# EAGLE design MyBuffer (EAGLE 9.0.1)
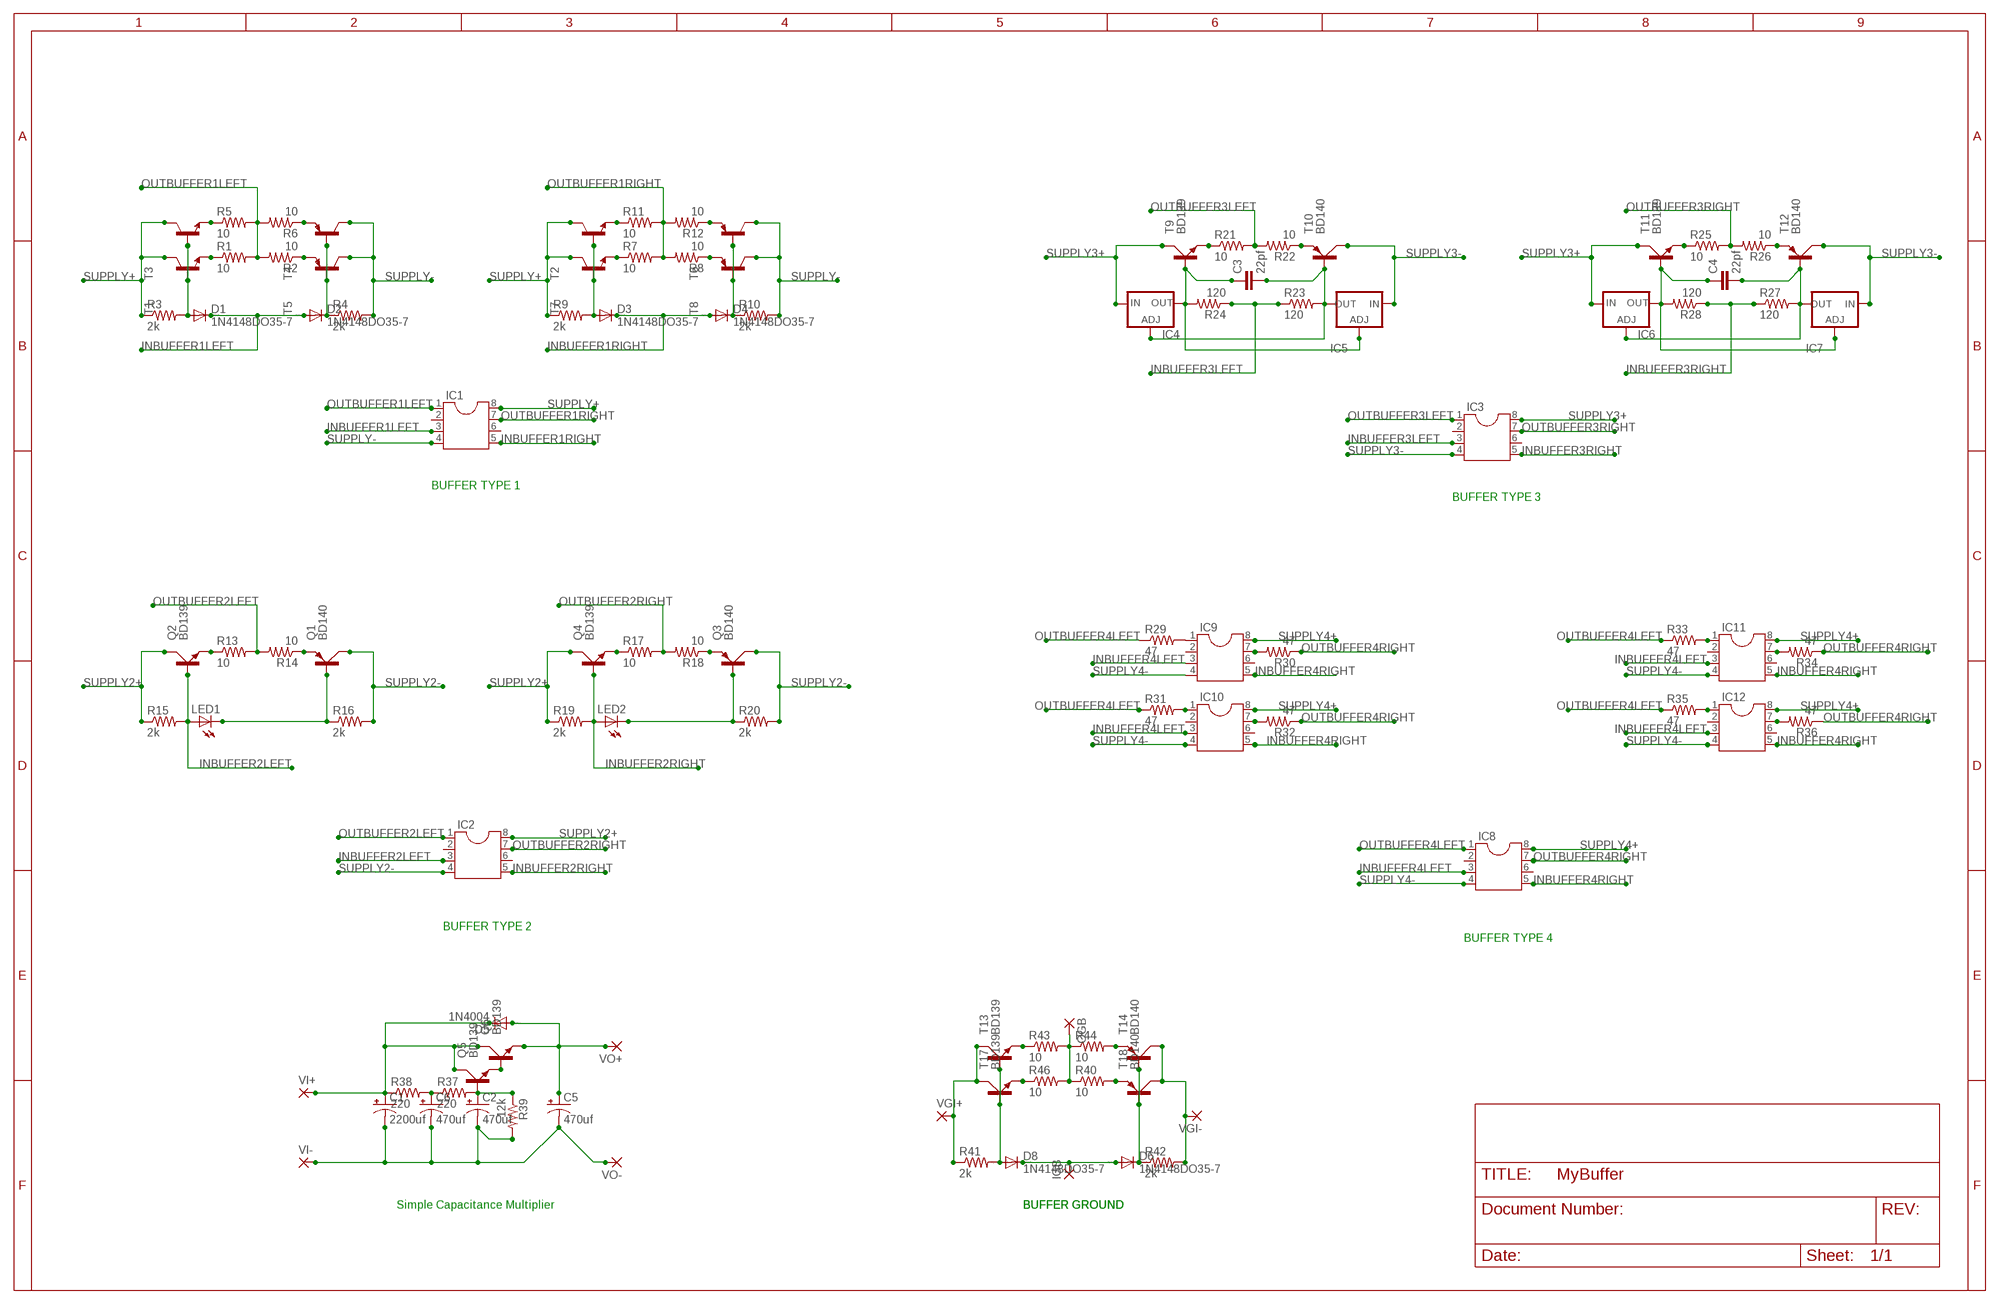
[diagram p0: schematic, sheet 1]

## Parts
C1  2200uf  CPOL-USE7.5-16  [E7,5-16]
C2  470uf  CPOL-USE7.5-16  [E7,5-16]
C3  22pf  C5/2.5  [C5B2.5]
C4  22pf  C5/2.5  [C5B2.5]
C5  470uf  CPOL-USE7.5-16  [E7,5-16]
C6  470uf  CPOL-USE7.5-16  [E7,5-16]
D1  1N4148DO35-7  [DO35-7]
D2  1N4148DO35-7  [DO35-7]
D3  1N4148DO35-7  [DO35-7]
D4  1N4148DO35-7  [DO35-7]
D5  1N4004  [DO41-10]
D6  1N4148DO35-7  [DO35-7]
D8  1N4148DO35-7  [DO35-7]
IC1  DIL8  [DIL08]
IC2  DIL8  [DIL08]
IC3  DIL8  [DIL08]
IC4  LM317TS  [317TS]
IC5  LM337TS  [337TS]
IC6  LM317TS  [317TS]
IC7  LM337TS  [337TS]
IC8  DIL8  [DIL08]
IC9  DIL8  [DIL08]
IC10  DIL8  [DIL08]
IC11  DIL8  [DIL08]
IC12  DIL8  [DIL08]
IGB  2,54/0,8  [2,54/0,8]
LED1  LED3MM  [LED3MM]
LED2  LED3MM  [LED3MM]
OGB  2,54/0,8  [2,54/0,8]
Q1  BD140  [TO126AV]
Q2  BD139  [TO126AV]
Q3  BD140  [TO126AV]
Q4  BD139  [TO126AV]
Q5  BD139  [TO126AV]
Q6  BD139  [TO126AV]
R1  10  R-US_0207/10  [0207/10]
R2  10  R-US_0207/10  [0207/10]
R3  2k  R-US_0207/10  [0207/10]
R4  2k  R-US_0207/10  [0207/10]
R5  10  R-US_0207/2V  [0207/2V]
R6  10  R-US_0207/2V  [0207/2V]
R7  10  R-US_0207/10  [0207/10]
R8  10  R-US_0207/10  [0207/10]
R9  2k  R-US_0207/10  [0207/10]
R10  2k  R-US_0207/10  [0207/10]
R11  10  R-US_0207/2V  [0207/2V]
R12  10  R-US_0207/2V  [0207/2V]
R13  10  R-US_0207/10  [0207/10]
R14  10  R-US_0207/10  [0207/10]
R15  2k  R-US_0207/10  [0207/10]
R16  2k  R-US_0207/10  [0207/10]
R17  10  R-US_0207/10  [0207/10]
R18  10  R-US_0207/10  [0207/10]
R19  2k  R-US_0207/10  [0207/10]
R20  2k  R-US_0207/10  [0207/10]
R21  10  R-US_0207/10  [0207/10]
R22  10  R-US_0207/10  [0207/10]
R23  120  R-US_0207/10  [0207/10]
R24  120  R-US_0207/10  [0207/10]
R25  10  R-US_0207/10  [0207/10]
R26  10  R-US_0207/10  [0207/10]
R27  120  R-US_0207/10  [0207/10]
R28  120  R-US_0207/10  [0207/10]
R29  47  R-US_0207/10  [0207/10]
R30  47  R-US_0207/10  [0207/10]
R31  47  R-US_0207/10  [0207/10]
R32  47  R-US_0207/10  [0207/10]
R33  47  R-US_0207/10  [0207/10]
R34  47  R-US_0207/10  [0207/10]
R35  47  R-US_0207/10  [0207/10]
R36  47  R-US_0207/10  [0207/10]
R37  220  R-US_0207/10  [0207/10]
R38  220  R-US_0207/10  [0207/10]
R39  12k  R-US_0207/10  [0207/10]
R40  10  R-US_0207/10  [0207/10]
R41  2k  R-US_0207/10  [0207/10]
R42  2k  R-US_0207/10  [0207/10]
R43  10  R-US_0207/10  [0207/10]
R44  10  R-US_0207/10  [0207/10]
R46  10  R-US_0207/10  [0207/10]
T1  29-NPN-TO92-EBC  [TO92-EBC]
T2  29-NPN-TO92-EBC  [TO92-EBC]
T3  29-NPN-TO92-EBC  [TO92-EBC]
T4  2N5401-PNP-TO92-EBC  [TO92-EBC]
T5  2N5401-PNP-TO92-EBC  [TO92-EBC]
T6  2N5401-PNP-TO92-EBC  [TO92-EBC]
T7  29-NPN-TO92-EBC  [TO92-EBC]
T8  2N5401-PNP-TO92-EBC  [TO92-EBC]
T9  BD139  [TO126AV]
T10  BD140  [TO126AV]
T11  BD139  [TO126AV]
T12  BD140  [TO126AV]
T13  BD139  [TO126AV]
T14  BD140  [TO126AV]
T17  BD139  [TO126AV]
T18  BD140  [TO126AV]
VGI+  2,54/0,8  [2,54/0,8]
VGI-  2,54/0,8  [2,54/0,8]
VI+  2,54/0,8  [2,54/0,8]
VI-  2,54/0,8  [2,54/0,8]
VO+  2,54/0,8  [2,54/0,8]
VO-  2,54/0,8  [2,54/0,8]

## Nets
INBUFFER1LEFT: D1.C D2.A IC1.3
INBUFFER1RIGHT: D3.C D4.A IC1.5
INBUFFER2LEFT: IC2.3 LED1.A Q2.B R15.2
INBUFFER2RIGHT: IC2.5 LED2.A Q4.B R19.2
INBUFFER3LEFT: IC3.3 R23.1 R24.1
INBUFFER3RIGHT: IC3.5 R27.1 R28.1
INBUFFER4LEFT: IC8.3 IC9.3 IC10.3 IC11.3 IC12.3
INBUFFER4RIGHT: IC8.5 IC9.5 IC10.5 IC11.5 IC12.5
N$1: R1.1 T1.E
N$2: R2.1 T5.E
N$3: D3.A R9.2 T2.B T7.B
N$4: D1.A R3.2 T1.B T3.B
N$5: D2.C R4.1 T4.B T5.B
N$6: R6.1 T4.E
N$7: R5.1 T3.E
N$8: D4.C R10.1 T6.B T8.B
N$10: R7.1 T7.E
N$11: R8.1 T8.E
N$12: R11.1 T2.E
N$13: R12.1 T6.E
N$15: Q2.E R13.1
N$16: Q4.E R17.1
N$17: Q1.E R14.1
N$18: Q3.E R18.1
N$19: LED2.K(C) Q3.B R20.1
N$21: LED1.K(C) Q1.B R16.1
N$22: R21.1 T9.E
N$23: R22.1 T10.E
N$24: C4.1 IC6.2(OUT) IC7.1(ADJ) R28.2 T11.B
N$25: C3.1 IC4.2(OUT) IC5.1(ADJ) R24.2 T9.B
N$26: C3.2 IC4.1(ADJ) IC5.3(OUT) R23.2 T10.B
N$27: C4.2 IC6.1(ADJ) IC7.3(OUT) R27.2 T12.B
N$28: R25.1 T11.E
N$29: R26.1 T12.E
N$31: IC9.1 R29.2
N$32: C2.+ Q5.B R37.2 R39.1
N$33: Q5.E Q6.B
N$34: IC9.7 R30.2
N$35: C6.+ R37.1 R38.2
N$36: C1.+ D5.C Q5.C Q6.C R38.1 VI+.1(P)
N$37: C1.- C2.- C5.- C6.- R39.2 VI-.1(P) VO-.1(P)
N$38: IC10.1 R31.2
N$39: C5.+ D5.A Q6.E VO+.1(P)
N$40: OGB.1(P) R40.1 R43.2 R44.1 R46.2
N$41: IC10.7 R32.2
N$42: R46.1 T17.E
N$43: IC11.1 R33.2
N$44: R40.2 T18.E
N$45: D6.C R42.1 T14.B T18.B
N$46: D8.A R41.2 T13.B T17.B
N$47: IC11.7 R34.2
N$48: R41.1 T13.C T17.C VGI+.1(P)
N$49: IC12.1 R35.2
N$50: R42.2 T14.C T18.C VGI-.1(P)
N$51: D6.A D8.C IGB.1(P)
N$52: R43.1 T13.E
N$53: IC12.7 R36.2
N$54: R44.2 T14.E
OUTBUFFER1LEFT: IC1.1 R1.2 R2.2 R5.2 R6.2
OUTBUFFER1RIGHT: IC1.7 R7.2 R8.2 R11.2 R12.2
OUTBUFFER2LEFT: IC2.1 R13.2 R14.2
OUTBUFFER2RIGHT: IC2.7 R17.2 R18.2
OUTBUFFER3LEFT: IC3.1 R21.2 R22.2
OUTBUFFER3RIGHT: IC3.7 R25.2 R26.2
OUTBUFFER4LEFT: IC8.1 R29.1 R31.1 R33.1 R35.1
OUTBUFFER4RIGHT: IC8.7 R30.1 R32.1 R34.1 R36.1
SUPPLY2+: IC2.8 Q2.C Q4.C R15.1 R19.1
SUPPLY2-: IC2.4 Q1.C Q3.C R16.2 R20.2
SUPPLY3+: IC3.8 IC4.3(IN) IC6.3(IN) T9.C T11.C
SUPPLY3-: IC3.4 IC5.2(IN) IC7.2(IN) T10.C T12.C
SUPPLY4+: IC8.8 IC9.8 IC10.8 IC11.8 IC12.8
SUPPLY4-: IC8.4 IC9.4 IC10.4 IC11.4 IC12.4
SUPPLY+: IC1.8 R3.1 R9.1 T1.C T2.C T3.C T7.C
SUPPLY-: IC1.4 R4.2 R10.2 T4.C T5.C T6.C T8.C
Unconnected: IC1.2 IC1.6 IC2.2 IC2.6 IC3.2 IC3.6 IC8.2 IC8.6 IC9.2 IC9.6 IC10.2 IC10.6 IC11.2 IC11.6 IC12.2 IC12.6

## Notes on the sheet
- BUFFER TYPE 1
- BUFFER TYPE 3
- BUFFER TYPE 2
- BUFFER TYPE 4
- Simple Capacitance Multiplier | BUFFER GROUND | BUFFER GROUND

## Library data of the parts
C1 C2 C5 C6 = rcl:CPOL-US: POLARIZED CAPACITOR, American symbol; SPICEPREFIX: C
C3 C4 = capacitor-wima:C: CAPACITOR naming: grid - package width
D1-D4 D6 D8 = diode:1N4148: DIODE high speed (Philips)
D5 = diode:1N4004: DIODE general purpose rectifier, 1 A
IC1-IC3 IC8-IC12 = ic-package:DIL8: Dual In Line / Socket
IC4 IC6 = v-reg:LM317TS: VOLTAGE REGULATOR
IC5 IC7 = v-reg:LM337TS: VOLTAGE REGULATOR
IGB OGB VGI+ VGI- VI+ VI- VO+ VO- = wirepad:2,54/0,8: THROUGH-HOLE PAD
LED1 LED2 = led:LED: LED OSRAM: - CHIPLED LG R971, LG N971, LY N971, LG Q971, LY Q971, LO R971, LY R971 LH N974, LH R974 LS Q976, LO Q976, LY Q976 LO Q996 - Hyper CHIPLED LW Q18S LB Q993, LB Q99A, LB R99A - SideLED LS A670, LO A670, LY A670, LG A670, LP A670 LB A673, LV A673, LT A673, LW A673 LH A674 LY A675 LS A676, LA A676, LO A676, LY A676, LW A676 LS A679, LY A679, LG A679 - Hyper Micro SIDELED® LS Y876, LA Y876, LO Y876, LY Y876 LT Y87S - SmartLED LW L88C, LW L88S LB L89C, LB L89S, LG L890 LS L89K, LO L89K, LY L89K LS L896, LA L896, LO L896, LY L896 - TOPLED LS T670, LO T670, LY T670, LG T670, LP T670 LSG T670, LSP T670, LSY T670, LOP T670, LYG T670 LG T671, LOG T671, LSG T671 LB T673, LV T673, LT T673, LW T673 LH T674 LS T676, LA T676, LO T676, LY T676, LB T676, LH T676, LSB T676, LW T676 LB T67C, LV T67C, LT T67C, LS T67K, LO T67K, LY T67K, LW E67C LS E67B, LA E67B, LO E67B, LY E67B, LB E67C, LV E67C, LT E67C LW T67C LS T679, LY T679, LG T679 LS T770, LO T770, LY T770, LG T770, LP T770 LB T773, LV T773, LT T773, LW T773 LH T774 LS E675, LA E675, LY E675, LS T675 LS T776, LA T776, LO T776, LY T776, LB T776 LHGB T686 LT T68C, LB T68C - Hyper Mini TOPLED® LB M676 - Mini TOPLED Santana® LG M470 LS M47K, LO M47K, LY M47K Source: http://www.osram.convergy.de LUXEON: - LUMILED® LXK2-PW12-R00, LXK2-PW12-S00, LXK2-PW14-U00, LXK2-PW14-V00 LXK2-PM12-R00, LXK2-PM12-S00, LXK2-PM14-U00 LXK2-PE12-Q00, LXK2-PE12-R00, LXK2-PE12-S00, LXK2-PE14-T00, LXK2-PE14-U00 LXK2-PB12-K00, LXK2-PB12-L00, LXK2-PB12-M00, LXK2-PB14-N00, LXK2-PB14-P00, LXK2-PB14-Q00 LXK2-PR12-L00, LXK2-PR12-M00, LXK2-PR14-Q00, LXK2-PR14-R00 LXK2-PD12-Q00, LXK2-PD12-R00, LXK2-PD12-S00 LXK2-PH12-R00, LXK2-PH12-S00 LXK2-PL12-P00, LXK2-PL12-Q00, LXK2-PL12-R00 Source: www.luxeon.com KINGBRIGHT: KA-3528ASYC Source: www.kingbright.com
Q1 Q3 T10 T12 T14 T18 = transistor-power:BD140: PNP TRANSISTOR
Q2 Q4-Q6 T9 T11 T13 T17 = transistor-power:BD139: NPN TRANSISTOR
R1-R44 R46 = resistor:R-US_: RESISTOR, American symbol
T1-T3 T7 = transistor:*-NPN-: NPN Transistror BF959 corrected 2008.03.06
T4-T6 T8 = transistor-neu-to92:*-PNP-: PNP Transistror

## Board
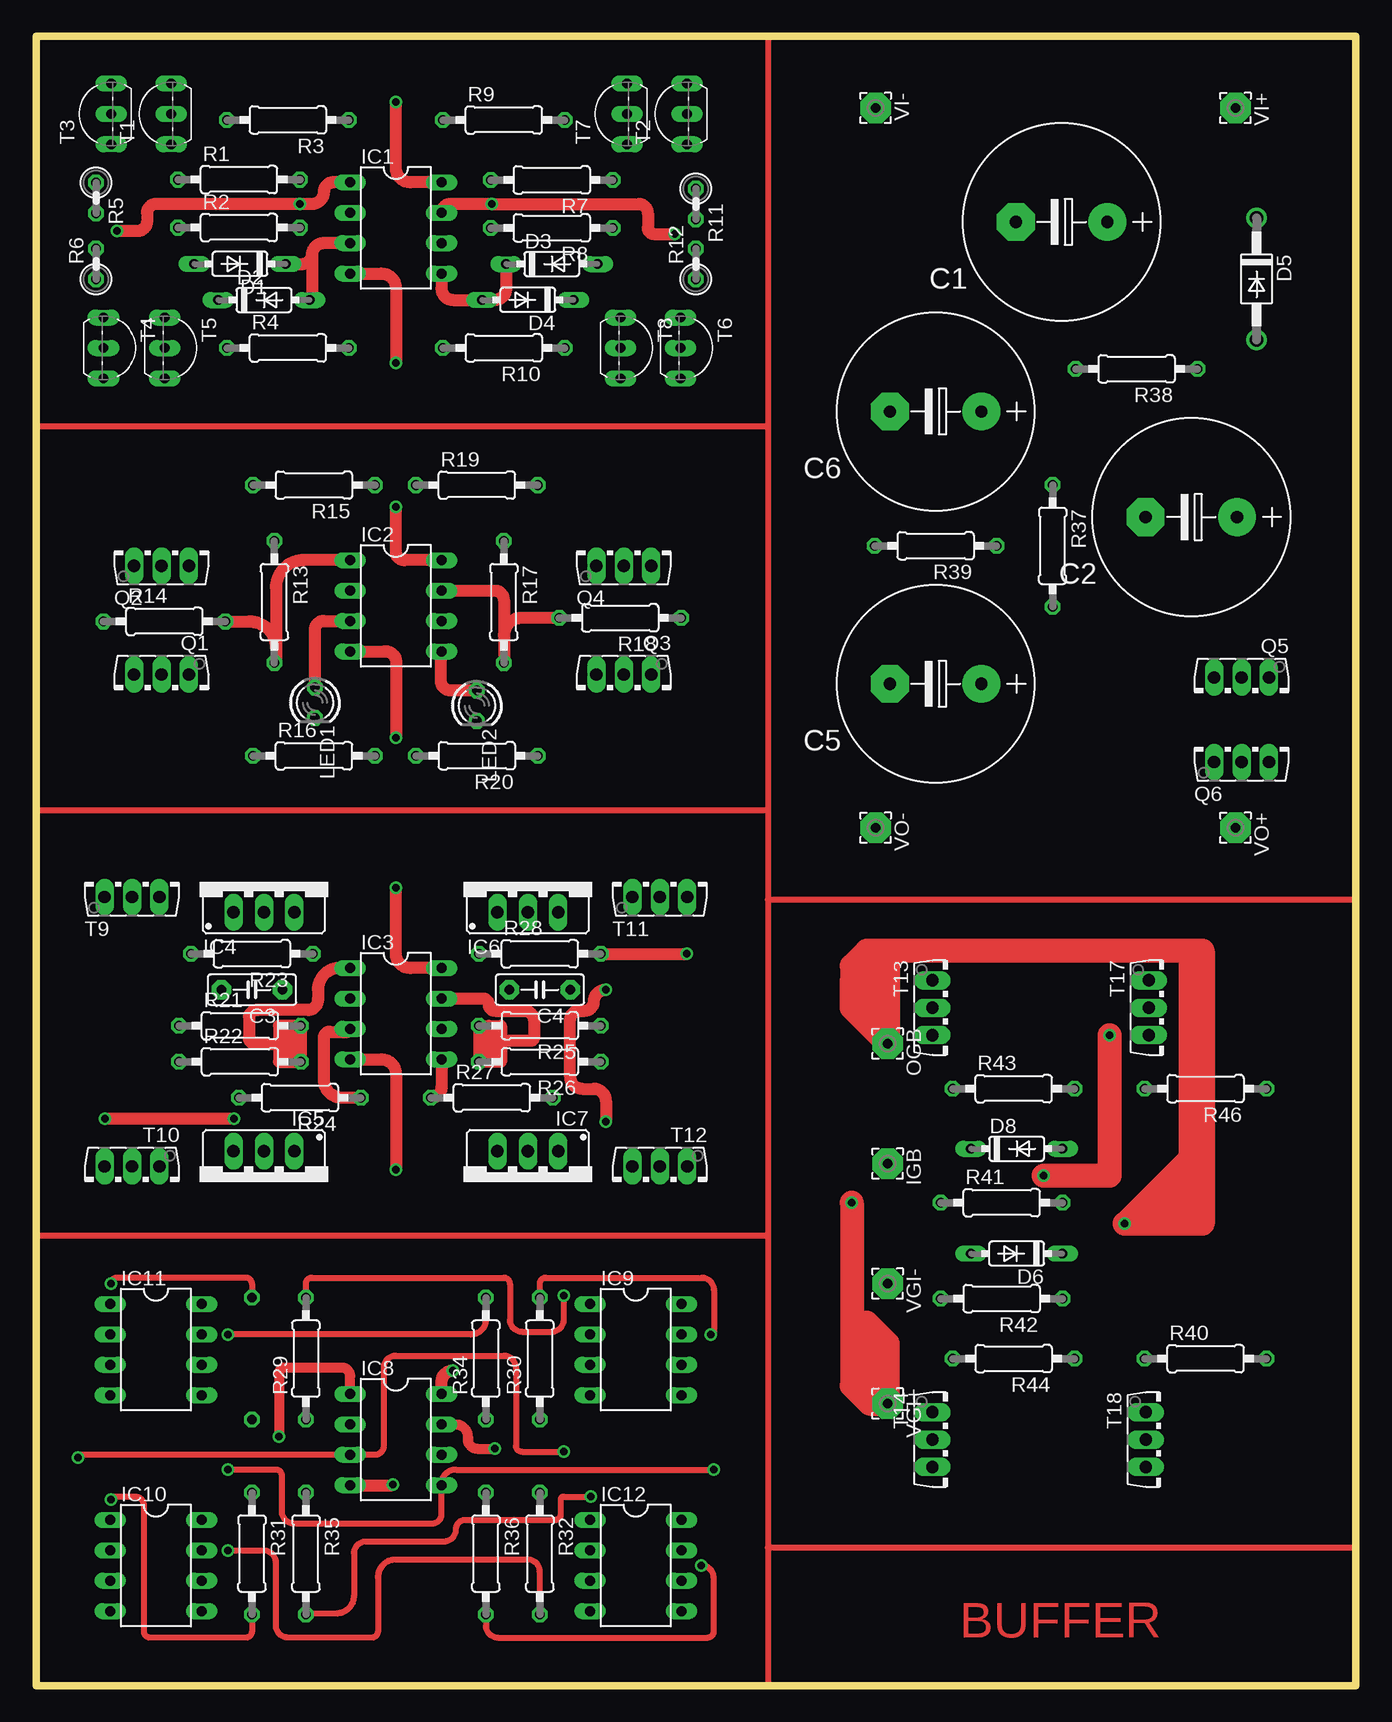
[diagram p1: board, top side]
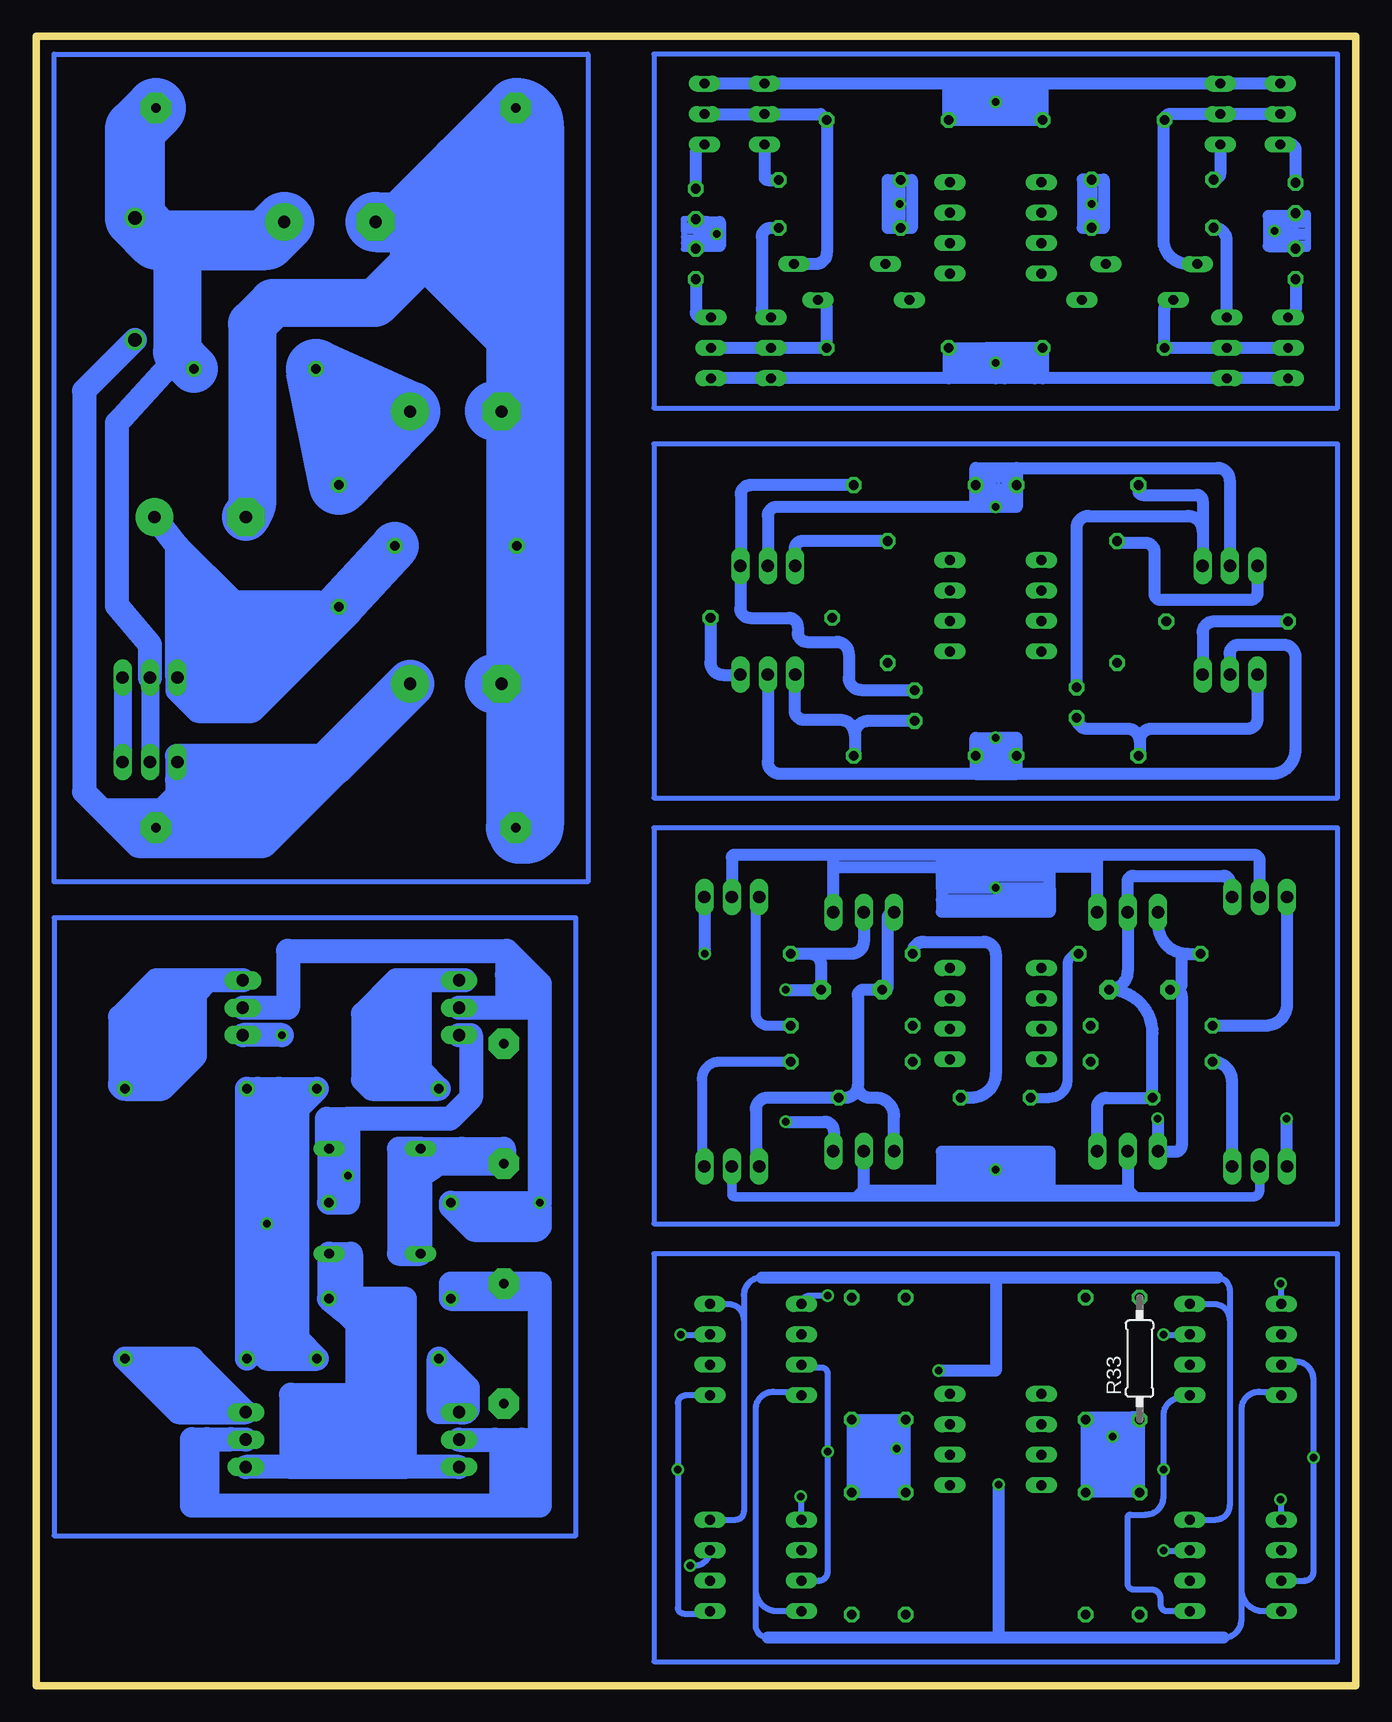
[diagram p2: board, bottom side, seen from below]

Size 110 x 137.5 mm. Coordinates in mm from the lower left corner, seen from the top.
Outline: 0,137.5 110,137.5 110,0 0,0 0,137.5
Copper layers (1*16): Top 0.035mm / dielectric 1.5mm / Bottom 0.035mm
Design rules "default *": minimum track width 6mil, minimum drill 0.35mm, track to track 8mil, track to pad 8mil, pad to pad 8mil, via to via 8mil, smd to smd 8mil, copper to edge 40mil, drill to drill 8mil, minimum pad ring 10mil, minimum via ring 8mil, stop-mask expansion 4mil, vias tented up to drill 0mil, thermal gap 10mil

### Footprints (pad centres in the part's own frame; a part is rotated, then mirrored left to right if it is on the bottom)
E7,5-16 = drill 1.016 pad 3.15: + -3.81,0 | drill 1.016 pad 3.15 octagon: - 3.81,0
C5B2.5 = drill 0.813 pad 1.6 octagon: 1 -2.54,0; 2 2.54,0
DO35-7 = drill 0.813 long: A 3.81,0; C -3.81,0
DO41-10 = drill 1.118: A 5.08,0; C -5.08,0
DIL08 = drill 0.813 long: 1 -3.81,-3.81; 2 -1.27,-3.81; 3 1.27,-3.81; 4 3.81,-3.81; 5 3.81,3.81; 6 1.27,3.81; 7 -1.27,3.81; 8 -3.81,3.81
317TS = drill 1.016 long: 1 -2.54,-2.54; 2 0,-2.54; 3 2.54,-2.54
337TS = drill 1.016 long: 1 -2.54,-2.54; 2 0,-2.54; 3 2.54,-2.54
2,54/0,8 = drill 0.813 pad 2.54 octagon: 1 0,0
LED3MM = drill 0.813 octagon: A -1.27,0; K 1.27,0
TO126AV = drill 1.016 long: B 2.286,-1.27; C 0,-1.27; E -2.286,-1.27
0207/10 = drill 0.813 octagon: 1 -5.08,0; 2 5.08,0
0207/2V = drill 0.813 octagon: 1 -1.27,0; 2 1.27,0
TO92-EBC = drill 0.813 long: B 0,-1.27; C 2.54,-1.27; E -2.54,-1.27

### Placement (x,y rotation side)
C1  85.5,122 180 top
C2  96.31,97.4 180 top
C3  18,58 180 top
C4  42,58 180 top
C5  75,83.5 180 top
C6  75,106.2 180 top
D1  17,118.5 180 top
D2  19,115.5 0 top
D3  43,118.5 0 top
D4  41,115.5 180 top
D5  101.75,117.25 270 top
D6  81.75,36 180 top
D8  81.75,44.75 0 top
IC1  30,121.5 270 top
IC2  30,90 270 top
IC3  30,56 270 top
IC4  19,67 0 top
IC5  19,42 180 top
IC6  41,67 0 top
IC7  41,42 180 top
IC8  30,20.5 270 top
IC9  50,28 270 top
IC10  10,10 270 top
IC11  10,28 270 top
IC12  50,10 270 top
IGB  71,43.5 270 top
LED1  23.25,81.93 270 top
LED2  36.75,81.68 270 top
OGB  71,53.5 270 top
Q1  10.46,83 180 top
Q2  10.46,94.6 0 top
Q3  49,83 180 top
Q4  49,94.6 0 top
Q5  100.5,82.75 180 top
Q6  100.5,78.25 0 top
R1  16.92,125.53 0 top
R2  16.92,121.53 0 top
R3  21,130.5 180 top
R4  21,111.5 0 top
R5  5,124 270 top
R6  5,118.5 90 top
R7  43,125.5 180 top
R8  43,121.5 180 top
R9  39,130.5 0 top
R10  39,111.5 180 top
R11  55,123.5 270 top
R12  55,118.5 90 top
R13  19.87,90.32 270 top
R14  10.7,88.7 0 top
R15  23.17,100.06 180 top
R16  23.17,77.5 0 top
R17  39,90.32 270 top
R18  48.7,89 180 top
R19  36.75,100.06 0 top
R20  36.75,77.5 180 top
R21  17,55 0 top
R22  17,52 0 top
R23  18,61 180 top
R24  22,49 180 top
R25  42,55 180 top
R26  42,52 180 top
R27  38,49 0 top
R28  42,61 0 top
R29  22.5,27.25 90 top
R30  42,27.25 90 top
R31  18,11 270 top
R32  42,11 270 top
R33  18,27.25 90 bottom
R34  37.5,27.25 90 top
R35  22.5,11 270 top
R36  37.5,11 270 top
R37  84.75,95 270 top
R38  91.75,109.75 180 top
R39  75,95 180 top
R40  97.5,27.25 0 top
R41  80.5,40.25 0 top
R42  80.5,32.25 180 top
R43  81.5,49.75 0 top
R44  81.5,27.25 180 top
R46  97.5,49.75 180 top
T1  10,131 90 top
T2  53,131 90 top
T3  5,131 90 top
T4  6.9,111.5 270 top
T5  12,111.5 270 top
T6  55,111.5 270 top
T7  48,131 90 top
T8  50,111.5 270 top
T9  8,67 0 top
T10  8,42 180 top
T11  52,67 0 top
T12  52,42 180 top
T13  76,56.5 270 top
T14  76,20.5 270 top
T17  94.03,56.5 270 top
T18  93.78,20.5 270 top
VGI+  71,23.5 270 top
VGI-  71,33.5 270 top
VI+  100,131.5 270 top
VI-  70,131.5 270 top
VO+  100,71.5 270 top
VO-  70,71.5 270 top

### Tracks (layer width: path | path; a pad name or v marks a point on that pad's centre or on a via)
INBUFFER1LEFT
  Top 1: IC1.3 23.98,120.23 arc90 23,119.25 | 23,119.25 23,115.69 arc-90 D2.A | D1.C 22.25,118.5 arc90 23,119.25
INBUFFER1RIGHT
  Top 1: IC1.5 33.81,116.44 arc90 34.75,115.5 D4.A 38.25,115.5 arc90 39.19,116.44 D3.C
INBUFFER2LEFT
  Top 1: LED1.A 23.25,88 arc-90 24,88.75 26.17,88.75 arc-90 IC2.3
  Bottom 1: 12.75,96.25 Q2.B arc-90 Q2.B | LED1.A 23.25,96.5 arc90 22.25,97.5 14,97.5 arc90 12.75,96.25 | R15.2 18.09,99.59 arc-90 17.75,99.25 13.25,99.25 arc90 12.75,98.75 12.75,96.25
INBUFFER2RIGHT
  Top 1: LED2.A 34.55,82.95 arc-90 33.75,83.75 33.75,86.13 arc-90 IC2.5
  Bottom 1: R19.2 50.44,100.06 arc-90 51.25,99.25 51.25,93.37 arc90 Q4.B 51.29,89.79 arc-90 50.5,89 47.25,89 arc90 46.5,88.25 46.5,87.75 arc-90 45.75,87 43.25,87 arc90 42.25,86 42.25,84 arc-90 41.25,83 36.8,83 arc90 LED2.A
INBUFFER3LEFT
  Top 1: R24.1 25.5,49 arc-90 24,50.5 24,54 arc-90 24.5,54.5 25.96,54.5 arc90 IC3.3
  Bottom 0.813: R24.1 25.5,49 arc-90 24,50.5 24,60.08 arc90 R23.1
INBUFFER3RIGHT
  Top 1: IC3.5 33.81,49.89 arc-90 R27.1
  Bottom 0.813: R28.1 36.92,61.08
  Bottom 1: 36.92,61.08 arc90 36,62 31,62 arc90 30,61 30,51 arc90 32,49 R27.1
INBUFFER4LEFT  (via drill 0.65)
  Top 0.508: v44,19.5 40.5,19.5 arc-90 40,20 40,26.5 arc90 39,27.5 30,27.5 arc90 29,26.5 29,20 arc-90 28.23,19.23 IC8.3 | v3.5,19 arc-90 3.73,19.23 IC8.3 | IC8.3 arc90 26.17,19.25
  Top 1.016: 26.17,19.25 25.5,19.25
  Bottom 0.508: IC10.3 4.27,8.73 arc-90 3.5,9.5 v3.5,19 3.5,25.5 arc-90 5,27 5.92,27 arc-90 IC11.3 | IC12.3 44.77,8.73 arc-90 44,9.5 v44,19.5 44,26 arc-90 44.5,26.5 45.96,26.5 arc90 IC9.3
INBUFFER4RIGHT  (via drill 0.65)
  Top 0.508: v56.5,18 35,18 arc90 33.81,16.81 | v16,18 20,18 arc-90 20.5,17.5 20.5,14.5 arc90 21.5,13.5 33,13.5 arc90 33.81,14.31 IC8.5
  Top 1.016: IC8.5 33.81,16.81
  Bottom 0.508: IC9.5 55.81,24.19 arc-90 56.5,23.5 v56.5,18 56.5,6.5 arc-90 56,6 54,6 arc-90 IC12.5 | IC11.5 arc90 14,24 14.5,24 arc-90 16,22.5 v16,18 16,15.75 arc90 17.5,14.25 18.75,14.25 arc-90 19,14 19,8.5 arc-90 18.5,8 17,8 arc90 16.25,7.25 16.25,6.75 arc-90 15.69,6.19 IC10.5
N$1
  Bottom 1: T1.E 11.27,126.1 arc90 R1.1
N$2
  Bottom 1: T5.E 10.73,120.42 arc-90 R2.1
N$3
  Bottom 1: T2.B T7.B 44.58,131 R9.2 44.08,119.42 arc90 45,118.5 D3.A
N$4
  Bottom 1: D1.A 14,118.5 arc90 16,120.5 16,130.42 | T3.B T1.B 15.42,131 arc-90 16,130.42 | R3.2 16,130.42
N$5
  Bottom 1: T4.B T5.B R4.1 15.92,114.77 arc90 D2.C
N$6
  Bottom 1: R6.1 5,114.67 arc90 T4.E
N$7
  Bottom 1: R5.1 5,128 arc-90 5.5,128.5 6.23,128.5 arc-90 T3.E
N$8
  Bottom 1: T6.B T8.B R10.1 44.08,114.77 arc-90 D4.C
N$9
  cutout Bottom: 1.5,136 58.5,136 58.5,106.5 1.5,106.5
  cutout Bottom: 64,136 108.5,136 108.5,67 64,67
  cutout Bottom: 65,64 108.5,64 108.5,12.5 65,12.5
N$10
  Bottom 1: T7.E 49.27,125.77 arc-90 49,125.5 R7.1
N$11
  Bottom 1: R8.1 48.75,121.5 arc-90 49.5,120.75 49.5,114.81 arc-90 T8.E
N$12
  Bottom 1: R11.1 55,127.73 arc90 T2.E
N$13
  Bottom 1: R12.1 55,114.5 arc-90 54.5,114 53.77,114 arc-90 T6.E
N$14
  cutout Bottom: 1.5,103.5 58.5,103.5 58.5,74 1.5,74
N$15
  Bottom 1: Q2.E 8.17,91.08 arc90 8.75,90.5 16.25,90.5 arc90 16.75,91 16.75,94.5 arc-90 17.5,95.25 19.72,95.25 arc90 R13.1
N$16
  Bottom 1: R17.1 46.1,95.4 arc-90 46.75,94.75 46.75,93.37 arc-90 Q4.E
N$17
  Bottom 1: R14.1 11.8,88.7 arc-90 12.75,87.75 Q1.E arc-90 Q1.E
N$18
  Bottom 1: R18.1 53.78,85.28 arc-90 52.75,84.25 51.31,84.25 arc-90 Q3.E
N$19
  Bottom 1: LED2.K 40.59,80.41 arc-90 41.75,79.25 | 41.75,79.25 41.75,77.58 arc90 R20.1 | 41.75,79.25 arc-90 43,80.5 46,80.5 arc90 46.75,81.25 46.75,84.23 arc90 Q3.B
N$20
  cutout Bottom: 1.5,38.5 1.5,71.5 58.5,71.5 58.5,38.5
N$21
  Bottom 1: Q1.B 8.17,80.58 arc90 9,79.75 17,79.75 arc-90 18,78.75 | 18,78.75 18,77.59 arc90 R16.1 | 18,78.75 arc-90 19,79.75 22.34,79.75 arc90 LED1.K
N$22
  Bottom 1: T9.E 5.71,56.79 arc90 7.5,55 R21.1
N$23
  Bottom 1: T10.E 10.29,50.37 arc-90 R22.1
N$24  (via drill 0.65 pad 0.65)
  Top 1: R28.2 v54.25,61 | v47.5,47 47.5,48.75 arc90 46.5,49.75 45.5,49.75 arc-90 44.54,50.71 44.54,55.54 arc-90 45.25,56.25 45.75,56.25 arc90 46.5,57 arc-90 v47.5,58
  Bottom 1: IC6.2 41,62 arc90 42,61 45.5,61 | 45.5,61 R28.2 | 45.5,61 arc90 44.54,60.04 C4.1 v47.5,58 | T11.B 54.29,61 v54.25,61 | v47.5,47 44.25,47 arc90 43.5,46.25 43.5,44.58 arc90 IC7.1
N$25
  Bottom 1: T9.B arc90 10.5,65.94 10.5,67 arc-90 11,67.5 18.5,67.5 arc-90 19,67 IC4.2 19,59.54 arc90 C3.1 arc90 16.92,54.38 R24.2 20.75,49 arc-90 21.54,48.21 IC5.1
N$26  (via drill 0.65 pad 0.65)
  Top 1: v16.5,47.25 v5.75,47.25
  Bottom 0.813: 14.5,60.5 arc90 14,61
  Bottom 1: 15,58 arc90 14.5,57.5 14.5,45 arc90 15,44.5 16.42,44.5 | 16.42,44.5 arc90 IC5.3 16.5,44.54 | C3.2 15,58 | 15,58 arc-90 14.5,58.5 14.5,60.5 | R23.2 14,61 arc90 16.46,63.46 IC4.1 | T10.B 5.75,43.27 v5.75,47.25 | v16.5,47.25 16.5,44.5 16.42,44.5
N$27
  Bottom 1: 41.5,50 41.5,57.5 arc90 41,58 C4.2 39.25,58 arc-90 39,58.25 39,63.92 arc90 IC6.1 | 41.5,50 arc90 42.5,49 R27.2 49,49 arc-90 50,48 50,43.56 arc-90 T12.B | IC7.3 38.46,47.46 arc-90 40,49 40.5,49 arc90 41.5,50
N$28
  Bottom 0.813: R25.1 49,55 arc90 50,56 50,65.44 arc90 T11.E
N$29
  Bottom 0.813: R26.1 53,52 arc-90 54.5,50.5 54.5,43.48 arc-90 T12.E
N$30
  cutout Bottom: 1.5,36 58.5,36 58.5,2 1.5,2
N$31  (via drill 0.65 pad 0.65)
  Top 0.508: R29.2 22.5,33.5 arc-90 23,34 39,34 arc-90 39.5,33.5 39.5,30.5 arc90 40.5,29.5 43,29.5 arc90 44,30.5 v44,32.5
  Bottom 0.508: v44,32.5 45.5,32.5 arc-90 IC9.1
N$32
  Bottom 2: 93.92,81.25 96.5,81.25 98.21,82.96 Q5.B 98.21,94.99 | 93.92,81.25 85.37,89.33 | 85.37,89.33 R37.2 | 98.21,94.99 C2.+ | 98.21,94.99 93.48,90.27 | 93.48,90.27 91.97,88.75 86.5,88.75 92.25,83 96.75,83 96.75,92 92.25,87.5 89.5,87.5 93,84 93,83.5 94,83.5 96,85.5 95.75,85.75 95.75,89.25 92.75,86.25 92.5,86.25 | 92.25,86.25 92.5,86.25 | 92.5,86.25 94,84.75 94.5,85.25 94.5,86.5 | 93.92,81.25 92,81.25 83.75,89.5 | 85.37,89.33 86.3,90.27 93.48,90.27
  Bottom 4: R39.1 R37.2
N$33
  Bottom 1.5: Q5.E Q6.B
N$34  (via drill 0.65 pad 0.65)
  Top 0.508: R30.2 42,33.5 arc-90 42.5,34 55.5,34 arc-90 56.5,33 56.5,29.5 arc-90 v56.25,29.25
  Bottom 0.508: v56.25,29.25 53.83,29.25 arc-90 IC9.7
N$35
  Bottom 5: R38.2 C6.+ R37.1 R38.2 | R38.2 83.75,104.5
N$36
  Bottom 1.5: Q5.C Q6.C
  Bottom 2: Q5.C 100.5,86.75 103.25,90 103.25,105.25 98.25,110.75 98.25,111.17
  Bottom 4: 99.92,120.5 arc90 98.25,118.83 98.25,111.17 R38.1
  Bottom 5: VI+.1 101.75,129.75 D5.C 99.92,120.5 90.81,120.5 C1.+
N$37
  Bottom 2: 70,106 70.99,106 C6.- 69.92,104.93 R39.2 69.92,84.77 C5.- 70,82.31 VO-.1
  Bottom 4: 77.5,119.25 77.75,119.5 78,119.5 78,119 81.75,115.25 90.25,115.25 92,113.5 92,98.4 C2.- | 77.5,119.25 77,119.75 77,120.25 | 77.5,119.25 77.75,119 78.5,119 78.5,119.5 77.25,120.75 78.5,122 C1.-
  Bottom 5: VI-.1 70,112.5 | 70,112.5 70,106 VO-.1 | C6.- 71.24,106.25 71.75,106.25 | C5.- 71.75,83.5 | 79.5,122 74.62,126.88 | 74.62,126.88 VI-.1 | C1.- 79.5,122 | 79.5,122 70,112.5 | 74.62,126.88 74,126.25 74,119.25 | VI-.1 arc90 68.5,130 68.5,71.75 arc90 69.25,71 69.75,71
N$38  (via drill 0.65 pad 0.65)
  Top 0.508: R31.2 18,4.5 arc-90 17.5,4 9.5,4 arc-90 9,4.5 9,15 arc90 8.25,15.75 6.5,15.75 arc90 v6.25,15.5
  Bottom 0.508: v6.25,15.5 6.25,13.87 arc-90 IC10.1
N$39
  Bottom 2: Q6.E 98.21,75.46 | 98.21,75.46 96.75,74 | 96.75,74 90.5,74 | 90.5,74 88.31,74 | 88.31,74 86.78,75.53 | 86.78,75.53 85.31,77 | D5.A 106,107.92 106,74.5 104.5,73 | 104.5,73 103,71.5 | 103,71.5 VO+.1 98.75,72.75 | 98.75,72.75 97.5,74 96.75,74 | 103,71.5 101.5,70 98.75,70 | 98.75,70 96.25,72.5 | 96.25,72.5 96.25,73.5 | 104.5,73 99.5,73 98.25,74.25 | 86.78,75.53 96.76,75.53 Q6.E | 98.75,70 96,70 | 96,70 92.31,70 | 92.31,70 88.31,74 | 90.5,74 92,72.5 96.25,72.5 | 96.25,72.5 95,71.25 92.75,71.25 | 96,70 96,70.75 96.25,71 | 92.31,70 91,70 83.75,77.25 | 85.31,77 98.19,77 Q6.E | 85.31,77 85.81,77.5 98.25,77.5 98.25,75.5 | 98.25,75.5 98.21,75.46 | Q6.E 98.21,75.54 98.25,75.5 | Q6.E 98.21,73.29 arc90 98.75,72.75
  Bottom 4: C5.+ 85.31,77
N$40  (via drill 0.65 pad 0.65)
  Top 2: 97.25,43.25 97.25,61.25 71,61.25 | 97.25,43.25 97.25,38.5 v90.75,38.5 96.25,44 96.25,60 | 71,61.25 OGB.1 68,56.5 68,58.5 | 97.25,43.25 94.25,40.25 | 93.75,39.75 94.25,40.25 | 94.25,40.25 96,40.25 | 68,58.5 68,58.75 | 68,58.75 69.5,57.25 | 69.5,57.25 69.5,56.25 | 69.5,57.25 69.5,61 69.75,61.25 | 69.75,61.25 69.25,61.25 68,60 68,58.75 | 68,58.5 70.25,60.75 70.25,61 | 71,61.25 69.75,61.25
  Bottom 2: 91.5,49.75 89.75,49.75 | 89.75,49.75 R43.2 88.25,48.08 88.25,28.92 R44.1 90.75,27.25 v90.75,38.5 90.75,49 91.5,49.75 | 89.75,49.75 89.75,28.5 89.25,28 | R40.1 R46.2 91.5,49.75
N$41  (via drill 0.65 pad 0.65)
  Top 0.508: R32.2 42,9.5 arc90 41,10.5 30,10.5 arc90 28.5,9 28.5,4.5 arc-90 28,4 21,4 arc-90 20,5 20,10.25 arc90 19,11.25 v16,11.25
  Bottom 0.508: v16,11.25 13.83,11.25 arc-90 IC10.7
N$42
  Bottom 2: R46.1 99.5,49.75 96.75,52.5 96.75,55 | 96.75,57.75 95.71,58.79 | T17.E 95.71,58.79 | 95.71,58.79 99.96,58.79 103,55.75 103,50.17 arc-90 R46.1 | R46.1 102.58,51.92 arc90 96.75,57.75 | 96.75,55 96.75,57.75 | 96.75,55 101,50.75 101,53.5 96.75,57.75
N$43  (via drill 0.65)
  Top 0.508: R33.2 18,33.5 arc90 17.5,34 6.75,34 arc90 v6.25,33.5
  Bottom 0.508: v6.25,33.5 6.25,31.87 arc-90 IC11.1
N$44
  Bottom 2: 96,23.75 97.5,23.75 99.75,26 99.75,27.25 96.97,27.25 T18.E 98.12,22.79 R40.2 99.5,27.25 96,23.75 | 95,23.75 96,23.75
N$45
  Bottom 2: 83.75,32.25 83.75,36 D6.C arc-90 85.58,35.98 R42.1 | 83.75,32.25 R42.1 | 79.25,18.21 79.25,24.25 | 79.25,24.25 79.25,27 | 79.25,27 79.25,28.25 | 79.25,28.25 79.25,32.25 83.75,32.25 | 83.25,24.25 88.75,24.25 88.75,18.21 | 83.25,24.25 79.25,24.25 | 88.75,18.21 T18.B | T14.B 79.25,18.21 | R42.1 84.2,31.11 | 84.2,31.11 81.76,29.09 81.76,23.74 | 79.25,27 80.9,28.37 80.9,24.6 81.76,23.74 | 79.25,28.25 82.25,31 82.5,31.5 80.25,30.75 | 88.75,18.21 79.25,18.21 | 79.25,18.21 80.79,19.75 87.5,19.75 87.75,20 87.75,23 80.75,23 80.5,23.25 80.5,20.75 86.75,20.75 86.75,22 81.5,22 | 84.2,31.11 83.25,30.16 83.25,24.25 | 81.76,23.74 82,23.5
N$46  (via drill 0.65 pad 0.65)
  Top 2: v84,42.5 89.5,42.5 v89.5,54.21
  Bottom 2: D8.A 84,44.75 | 84,44.75 v84,42.5 84,40.25 R41.2 85.58,44.73 arc90 D8.A | 84,47.25 84,44.75 | 84,47.25 75.5,47.25 73.75,49 73.75,54.21 T13.B | v89.5,54.21 T17.B | D8.A arc90 85.75,44.94 85.75,47.25 84,47.25
N$47  (via drill 0.65 pad 0.65)
  Top 0.508: R34.2 37.5,30.5 arc-90 36.27,29.27 16.02,29.27 arc90 v16,29.25
  Bottom 0.508: v16,29.25 13.83,29.25 arc-90 IC11.7
N$48  (via drill 0.65 pad 0.65)
  Top 2: v68,40.25 68,25 69.5,23.5 VGI+.1 71,28.5 69.62,29.88 | 69.62,29.88 69.25,30.25 69,30 68.5,30 | 69.62,29.88 69.62,24.88 69.75,24.75
  Bottom 2: 70.75,61.25 89,61.25 89,56.5 T17.C | 70.75,59.25 70.75,56.5 | 68,56.5 v68,40.25 R41.1 75.42,39.92 74.12,38.62 | 68,56.5 70.75,56.5 | 70.75,56.5 T13.C | 74.12,38.62 73.5,38 68.25,38 68,38.25 68,39.75 | 74.12,38.62 69.12,38.62 68.75,39 | 68,56.5 68,58.5 70.75,61.25 | 70.75,61.25 70.75,59.25 | 70.75,59.25 69,57.5
N$49  (via drill 0.65 pad 0.65)
  Top 0.508: R35.2 arc-90 22.58,6 25,6 arc90 26.5,7.5 26.5,11 arc-90 27.5,12 34,12 arc90 35,13 arc-90 35.81,13.81 43.31,13.81 arc90 43.75,14.25 43.75,15.5 arc-90 44,15.75 v46.25,15.75
  Bottom 0.508: v46.25,15.75 46.25,13.87 arc-90 IC12.1
N$50
  Bottom 2: 68,20.5 68,15 97,15 97,20.54 95.75,20.54 | 68,20.5 68,32.25 | 68,32.25 68,33.5 VGI-.1 75.42,33.5 R42.2 68,32.25 | 95.75,20.54 93.75,20.54 T18.C | T14.C 71.75,20.5 | 71.75,20.5 69.5,20.5 | 69.5,20.5 68,20.5 | 95.75,20.54 95.75,16 | 71.75,20.5 71.25,20 71.25,15.75 | 69.5,20.5 69.5,15.75
N$51
  Bottom 2: 77.94,42.5 D6.A 79.75,36 79.75,44.75 D8.C | 77.94,42.5 D8.C | D8.C 74.5,44.75 | 74.5,44.75 71,44.75 IGB.1 76.59,43.5 76.94,43.16 | 77.94,42.5 76.94,43.16 | 76.94,43.16 74.5,44.75
N$52
  Bottom 2: 74.26,58.79 T13.E 79.25,58.79 | 79.25,58.79 79.96,58.79 82.75,56 82.75,50.5 82,49.75 R43.1 78,51.33 78,57.75 | 79.25,58.79 79.25,50.75 | 79.25,50.75 79,50.5 | 79.25,50.75 79.75,51.25 81.25,51.25 81.75,51.75 81.75,56 80.75,57 80.25,57 80.25,52 80.5,51.75
N$53  (via drill 0.65 pad 0.65)
  Top 0.508: R36.2 37.5,5 arc90 38.5,4 56,4 arc90 56.5,4.5 56.5,9 arc90 v55.45,10
  Bottom 0.508: v55.45,10 55.08,10 arc-90 IC12.7
N$54
  Bottom 2: 74.5,23.5 74.5,25.33 | 74.5,25.33 R44.2 76.42,22.79 T14.E 74.21,22.79 74,23 74,24.83 74.5,25.33
N$55
  Bottom 0.406: 1.5,136 58.5,136 58.5,106.5 1.5,106.5 1.5,136
N$56
  Bottom 0.406: 1.5,74 1.5,103.5 58.5,103.5 58.5,74 1.5,74
N$57
  Bottom 0.406: 1.5,71.5 58.5,71.5 58.5,38.5 1.5,38.5 1.5,71.5
N$58
  Bottom 0.406: 58.5,2 1.5,2 1.5,36 58.5,36 58.5,2
N$59
  Bottom 0.406: 64,136 64,67 108.5,67 108.5,136 64,136
N$60
  Bottom 0.406: 108.5,12.5 65,12.5 65,64 108.5,64 108.5,12.5
N$61
  Top 0.5: 61,137.5 61,105 | 61,105 61,73 | 61,73 61,65.5 | 61,65.5 61,37.5 | 61,37.5 61,11.5 | 61,11.5 61,0 | 61,37.5 0,37.5 | 0,73 61,73 | 0,105 61,105 | 110,65.5 61,65.5 | 110,11.5 61,11.5
OUTBUFFER1LEFT  (via drill 0.65)
  Top 1: IC1.1 24.81,125.31 arc90 24,124.5 arc-90 23,123.5 v22,123.5 10,123.5 arc90 9.25,122.75 9.25,122 arc-90 8.5,121.25 v6.75,121.25
  Bottom 0.5: R5.2 6,122.73 6,122.5 6,122.25 | 6,122.25 6,121.75 | 6,119.75 6,119.77 | 6,119.77 R6.2 | R6.2 4,119.77 | 4,119.77 4,119.75 | R5.2 4,122.73 4,122.25 | R6.2 R5.2 | R6.2 5,122.25 | 5,122.25 5.75,122.25 6,122.25 | 5,122.25 4,122.25 | 4,122.25 4,121.75 | 4,121.75 4,121.25 | 4,121.75 6,121.75 | 6,121.75 6,121.25 | 6,121.25 6,120.75 | 6,121.25 5.75,121.25 4,121.25 | 4,121.25 4,120.75 | 4,120.75 4,120.25 | 4,120.25 4,119.77 | 4,120.75 6,120.75 | 6,120.75 6,120.25 | 6,120.25 6,119.77 | 6,120.25 5.5,120.25 4,120.25
  Bottom 1: R1.2 v22,123.5 R2.2 | v6.75,121.25 5.75,121.25 | R1.2 22.75,125.53 22.75,121.5 21,121.5 21,125.53 R1.2 | 7.25,120 7.25,122.5 6,122.5 arc90 5.75,122.25 6.75,122 | 7.25,120 5.75,120 arc-90 5.5,120.25 | 7.25,120 6,120.75
OUTBUFFER1RIGHT  (via drill 0.65)
  Top 1: v53.25,121 51.5,121 arc-90 51,121.5 51,122.75 arc90 50.25,123.5 v38,123.5 34.54,123.5 arc90 IC1.7
  Bottom 0.5: R11.2 55.98,122.23 | 55.98,122.23 arc90 56,122.25 | R12.2 55,119.75 54,119.75 54,120.25 | 54,121.75 54,122.23 | 54,122.25 54,122.23 | 54,122.23 R11.2 | R11.2 R12.2 | R12.2 55.98,119.77 55.98,120.25 | 55.98,121.25 55.98,121.75 | 55.98,121.75 55.98,122.23 | 55.98,121.75 54,121.75 | 54,121.75 54,121.25 | 54,121.25 54,120.75 | 54,121.25 54.25,121.25 55.98,121.25 | 55.98,121.25 55.98,120.75 | 55.98,120.75 55.98,120.25 | 55.98,120.75 54,120.75 | 54,120.75 54,120.25 | 54,120.25 55.98,120.25
  Bottom 0.813: 38,125.5 R7.2 | v38,123.5 37.92,123.5 | R8.2 38,121.5
  Bottom 1: 38,121.5 v38,123.5 38,125.5 39,125.5 39,121.5 R8.2 37,121.5 37,125.5 R7.2 | v53.25,121 54,121 arc90 54.25,121.25 | R11.2 55,122 53,122 53,120 54,120 54,120.25
OUTBUFFER2LEFT
  Top 0.61: 20,85.38 arc-90 R13.2
  Top 1: IC2.1 22.31,93.81 arc90 20,91.5 20,86.5 | 20,86.5 20,85.38 arc-90 R13.2 | R14.2 17.8,88.7 arc-90 20,86.5
OUTBUFFER2RIGHT
  Top 1: IC2.7 38.23,91.27 arc-90 39,90.5 39,87.5 | 39,87.5 R17.2 | R18.2 40.5,89 arc90 39,87.5
OUTBUFFER3LEFT
  Top 1: IC3.1 25.31,59.81 arc90 23.5,58 23.5,57.25 arc-90 22.75,56.3 18.5,56.3 arc90 17.75,55.75 17.75,54 arc90 18.25,53.5 20.25,53.5 | 21.25,55 R21.2 R22.2 21.25,52 | 21.25,55 21.25,52 | 21.25,55 20.25,55 20.25,53.5 | 20.25,53.5 20.25,52 21.25,52
OUTBUFFER3RIGHT
  Top 0.813: 37,55.08 arc-90 R25.2
  Top 1: 37.75,55 R25.2 R26.2 37.75,52 | 37.75,55 37.75,52 | 37.75,55 38.75,55 38.75,53.5 | 38.75,53.5 38.75,52 37.75,52 | 38.75,53.5 arc-90 39,53.75 41.25,53.75 arc90 41.5,54 41.5,55.5 arc90 40.75,56.25 38.25,56.25 arc-90 37.75,56.75 arc90 37.23,57.27 IC3.7
OUTBUFFER4LEFT  (via drill 0.6)
  Top 0.813: IC8.1 26.19,25.81 arc90 25.5,26.5 20.75,26.5 arc90 20.25,26 v20.25,20.75
  Bottom 0.813: R31.1 19.25,16.08 | 19.25,16.08 R35.1 R29.1 22.5,22.42 22,22.42 | 22,22.42 18.75,22.42 | R31.1 R33.1 18,22.42 18.75,22.42 | R31.1 18.75,16.08 18.75,22 | 18.75,22 18.75,22.42 | 18.75,22 19.25,22 | 19.25,22 22,22 | 22,22 22,22.42 | 22,22 22,21.25 | 22,21.25 22,16.5 19.25,16.5 | 19.25,16.5 19.25,16.08 | 19.25,16.5 19.25,21.25 | 19.25,21.25 19.25,22 | 19.25,21.25 21.5,21.25 | 21.5,21.25 22,21.25 | 21.5,21.25 21.5,17 19.75,17 19.75,20.75 v20.25,20.75 21,20.75 21,17.5 20.25,17.5 20.25,20.25
OUTBUFFER4RIGHT  (via drill 0.65)
  Top 0.813: IC8.7 34.98,21.77 arc-90 36,20.75 36,20.5 arc90 36.75,19.75 v38.25,19.75
  Bottom 0.813: R30.1 R34.1 R36.1 R32.1 R30.1 | 39.75,18.75 40,18.75 40,20.25 40.5,20.25 40.5,18 39.25,18 39.25,20.75 41,20.75 41,17.5 38.75,17.5 38.75,21.25 41.5,21.25 41.5,16.75 38.25,16.75 v38.25,19.75 38.25,21.75 41.5,21.75 41.5,22.17 R30.1
SUPPLY2+  (via drill 0.65)
  Top 1: IC2.8 30.69,93.81 arc-90 30,94.5 v30,98.25
  Bottom 1: 28.25,101.5 31.67,101.5 R19.1 | 28.25,101.5 R15.1 28.25,98.25 v30,98.25 31.67,98.25 | 31.67,98.25 R19.1 | R19.1 31,100.06 31,99 29,99 | 28.75,99 29,99 | 30.5,100.75 29,100.75 29,99 | 31,100.75 30.5,100.75 | 30.5,100.75 30.5,99.75 29.75,99.75 | 31.67,98.25 48.25,98.25 arc-90 49,97.5 Q4.C | 28.25,101.5 11.5,101.5 arc90 10.5,100.5 10.5,93.37 arc-90 Q2.C
SUPPLY2-  (via drill 0.65)
  Top 1: IC2.4 29.06,86.19 arc-90 30,85.5 v30,79
  Bottom 1: Q3.C 49,77 arc-90 48,76 31.67,76 | R20.2 31.67,76 | 28.25,76 R16.2 28.25,79 v30,79 31.67,79 31.67,78.25 | 31.67,76 28.25,76 | R20.2 31.67,78.25 | 31.67,78.25 29,78.25 29,76.75 31,76.75 31,77.5 | R20.2 29.5,77.5 | 28.25,76 7,76 arc-90 5,78 5,85.75 arc-90 6,86.75 9.75,86.75 arc-90 10.5,86 10.5,84.31 arc-90 Q1.C
SUPPLY3+  (via drill 0.65)
  Top 1: IC3.8 31.19,59.81 arc-90 30,61 v30,66.5
  Bottom 1: 25.5,66.5 v30,66.5 34.5,66.5 | 25.5,66.5 25.5,65.5 | 25.5,65.5 25.5,64.5 34.5,64.5 34.5,65.5 | 34.5,66.5 34.5,65.5 | T9.C 8,68.75 arc-90 8.5,69.25 21.54,69.25 | 21.54,69.25 25.75,69.25 | 25.75,69.25 34.5,69.25 | 34.5,69.25 43.54,69.25 | 43.54,69.25 51.75,69.25 arc-90 52,69 T11.C | 25.5,66.5 25.5,67.5 | 25.5,67.5 25.5,68.5 | 25.5,68.5 25.5,69 arc-90 25.75,69.25 | 34.5,66.5 34.5,67.5 | 34.5,67.5 34.5,68.5 | 34.5,68.5 34.5,69.25 | 34.5,68.5 25.5,68.5 | 25.5,67.5 34.5,67.5 | 34.5,65.5 25.5,65.5 | IC4.3 21.54,68.25 | 21.54,68.25 21.54,69.25 | IC6.3 43.54,68.25 | 43.54,68.25 43.54,69.25 | 21.54,68.25 25.25,68.25 25.5,68.5 | 43.54,68.25 34.75,68.25 34.5,68.5
SUPPLY3-  (via drill 0.65 pad 0.65)
  Top 1: IC3.4 28.81,52.19 arc-90 30,51 v30,43
  Bottom 0.8: T10.C 8,41.25 arc90 8.5,40.75 18.25,40.75 | 18.25,40.75 19,41.5 | T12.C 52,41 arc-90 51.75,40.75 41.75,40.75 | 41.75,40.75 41,41.5 | 18.25,40.75 41.75,40.75
  Bottom 1: IC5.2 19,41.5 arc90 19.25,41.25 25.5,41.25 | 25.5,41.25 26.25,41.25 | 26.25,41.25 27.25,41.25 | 27.25,41.25 28,41.25 | 28,41.25 29,41.25 | 29,41.25 30,41.25 | 30,41.25 30.75,41.25 | 30.75,41.25 31.25,41.25 | 31.25,41.25 32,41.25 | 32,41.25 33,41.25 | 33,41.25 33.75,41.25 | 33.75,41.25 34.5,41.25 | 34.5,41.25 40.75,41.25 arc90 41,41.5 IC7.2 | 25.5,41.25 25.5,44.5 26.25,44.5 | 26.25,44.5 27,44.5 | 27,44.5 28,44.5 | 28,44.5 28.75,44.5 | 28.75,44.5 29.75,44.5 | 29.75,44.5 30.75,44.5 | 30.75,44.5 31.25,44.5 | 31.25,44.5 32.25,44.5 | 32.25,44.5 33,44.5 | 33,44.5 33.75,44.5 | 33.75,44.5 34.5,44.5 34.5,41.25 | 26.25,41.25 26.25,44.5 | 27.25,41.25 27.25,44.25 arc90 27,44.5 | 28,41.25 28,44.5 | 29,41.25 29,44.25 arc90 28.75,44.5 | 33.75,41.25 33.75,44.5 | 33,41.25 33,44.5 | 32,41.25 32,44.25 arc-90 32.25,44.5 | 31.25,41.25 31.25,44.5 | 30.75,41.25 30.75,44.5 | 30,41.25 v30,43 30,44.25 arc90 29.75,44.5
SUPPLY4+  (via drill 0.65 pad 0.65)
  Top 1: IC8.8 33.81,25.31 arc-90 v34.75,26.25
  Bottom 0.508: IC10.8 11.69,13.81 arc-90 10.5,15 10.5,30.5 | IC12.8 51.69,13.81 arc-90 51,14.5 51,30.5 | 11.5,34 arc90 10.5,33 10.5,30.5 | IC11.8 11.81,31.81 arc90 10.5,30.5 | 49.5,34 arc-90 51,32.5 51,30.5 | IC9.8 52.31,31.81 arc90 51,30.5
  Bottom 1: 11.5,34 30,34 | 30,34 49.5,34 | 30,34 30,26.25 v34.75,26.25
SUPPLY4-  (via drill 0.65 pad 0.65)
  Top 1: IC8.4 29.69,16.69 arc90 v29.75,16.75
  Bottom 0.508: 11,4 arc-90 9.5,5.5 9.5,8 | 49,4 arc90 50,5 50,8 | 50,8 50,23 arc90 48.5,24.5 46.5,24.5 arc90 IC9.4 | IC12.4 48.19,6.19 arc90 50,8 | IC11.4 arc-90 6.5,24.5 8,24.5 arc-90 9.5,23 9.5,8 | IC10.4 7.69,6.19 arc90 9.5,8
  Bottom 1: 11,4 29.75,4 | 29.75,4 49,4 | 29.75,4 v29.75,16.75
SUPPLY+  (via drill 0.65)
  Top 1: IC1.8 31.19,125.31 arc-90 30,126.5 v30,132
  Bottom 1: v30,132 R3.1 | v30,132 R9.1 | T3.C T1.C 26.08,133.54 | T2.C T7.C 33.92,133.54 | 26.08,133.54 30,133.54 | 30,133.54 33.92,133.54 | 30,133.54 v30,132 | R3.1 26.08,133.54 | R9.1 33.92,132.75 | 33.92,132.75 33.92,133.54 | R3.1 26.08,132.75 33.75,132.75 | 33.75,132.75 33.92,132.75 | 33.75,132.75 33.75,132 v30,132 | v30,132 26.5,132 26.5,131.25 33.25,131.25 | R3.1 R9.1
SUPPLY-  (via drill 0.65)
  Top 1: IC1.4 28.81,117.69 arc-90 30,116.5 v30,110.25
  Bottom 1: v30,110.25 R4.2 | v30,110.25 R10.2 | T4.C T5.C 26.08,108.96 | 26.75,108.96 29.25,108.96 | 29.25,108.96 30,108.96 | 30,108.96 33.92,108.96 | 33.92,108.96 T8.C T6.C | v30,110.25 30,108.96 | R4.2 26.08,108.96 | 26.08,108.96 26.75,108.96 | 26.75,108.96 26.75,110.75 29.25,110.75 29.25,109.5 | 29.25,108.96 29.25,109.5 | 29.25,109.5 27.5,109.5 27.5,110.25 28.5,110.25 | R10.2 33.92,108.96 | R10.2 30.75,111.5 | 30.75,111.5 30.75,110.5 33.25,110.5 33.25,109.75 30.5,109.75 | R4.2 30.75,111.5 | 30.75,111.5 30,110.75

### Text on the board
Top: BUFFER